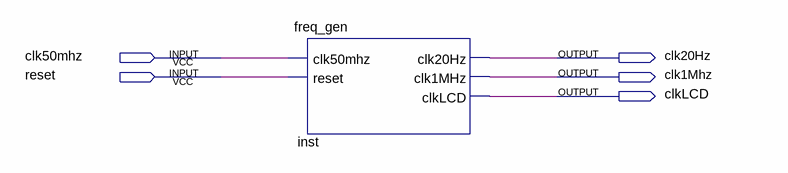
[diagram p0: schematic sheet]
// Quartus schematic test_freq_gen.bdf as structural Verilog: 1 symbols, 5 pins
module test_freq_gen (
  input  clk50mhz,
  input  reset,
  output clk20Hz,
  output clk1Mhz,
  output clkLCD
);

  freq_gen inst (.clk50mhz(clk50mhz), .reset(reset), .clk20Hz(clk20Hz), .clk1MHz(clk1Mhz), .clkLCD(clkLCD));
endmodule
